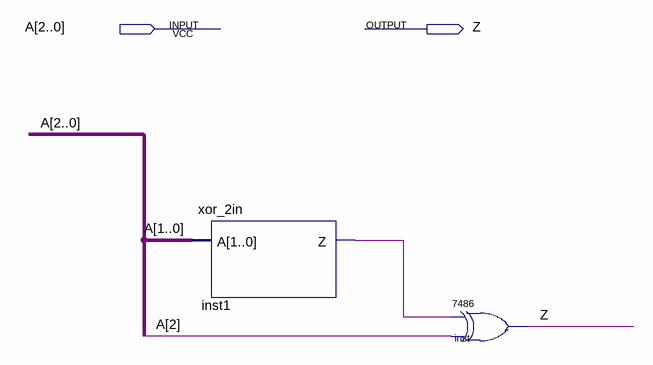
[diagram p0: schematic sheet]
// Quartus schematic xor_3in.bdf as structural Verilog: 2 symbols, 2 pins
module xor_3in (
  input  [2:0] A,
  output Z
);

  wire inst1_z;

  xor_2in inst1 (.A(A[1:0]), .Z(inst1_z));
  \7486  inst (.\2 (inst1_z), .\3 (A[2]), .\1 (Z));
endmodule
